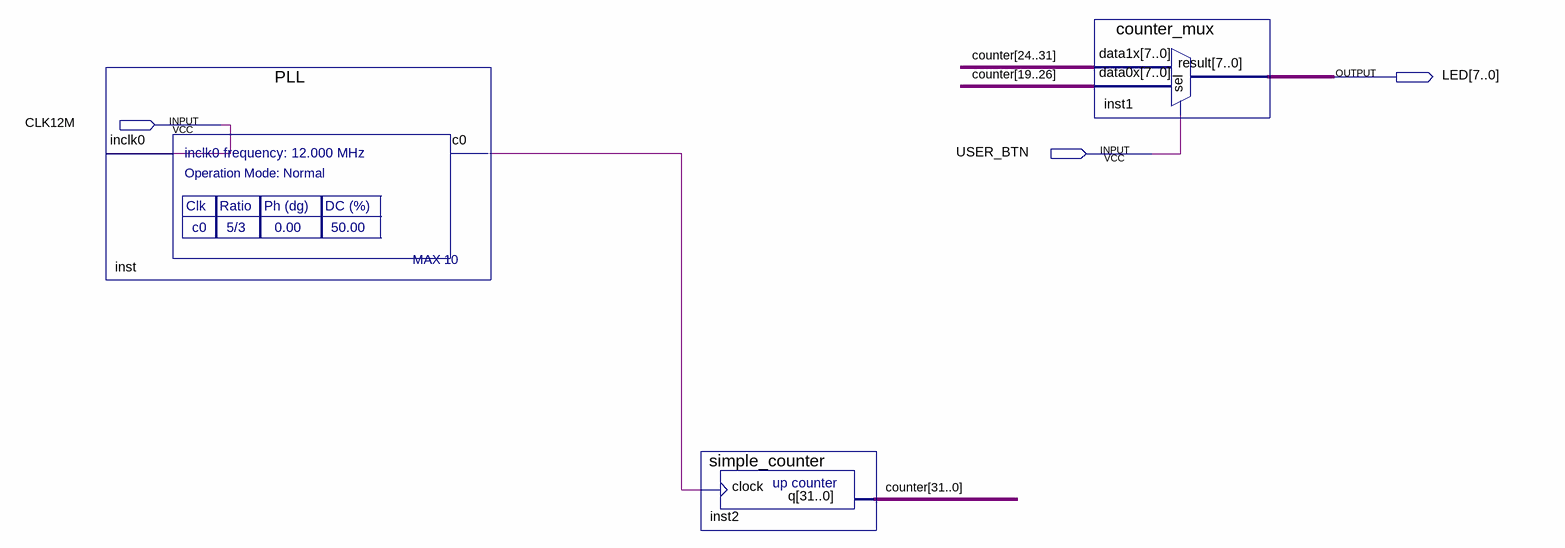
[diagram p0: schematic sheet]
// Quartus schematic top.bdf as structural Verilog: 3 symbols, 3 pins
module top (
  input  CLK12M,
  input  USER_BTN,
  output [7:0] LED
);

  wire inst_c0;
  wire [31:0] counter;

  PLL inst (.inclk0(CLK12M), .c0(inst_c0));
  simple_counter inst2 (.clock(inst_c0), .q(counter));
  counter_mux inst1 (
    .data1x({counter[24], counter[25], counter[26], counter[27], counter[28], counter[29], counter[30], counter[31]}),
    .data0x({counter[19], counter[20], counter[21], counter[22], counter[23], counter[24], counter[25], counter[26]}),
    .sel(USER_BTN), .result(LED));
endmodule
